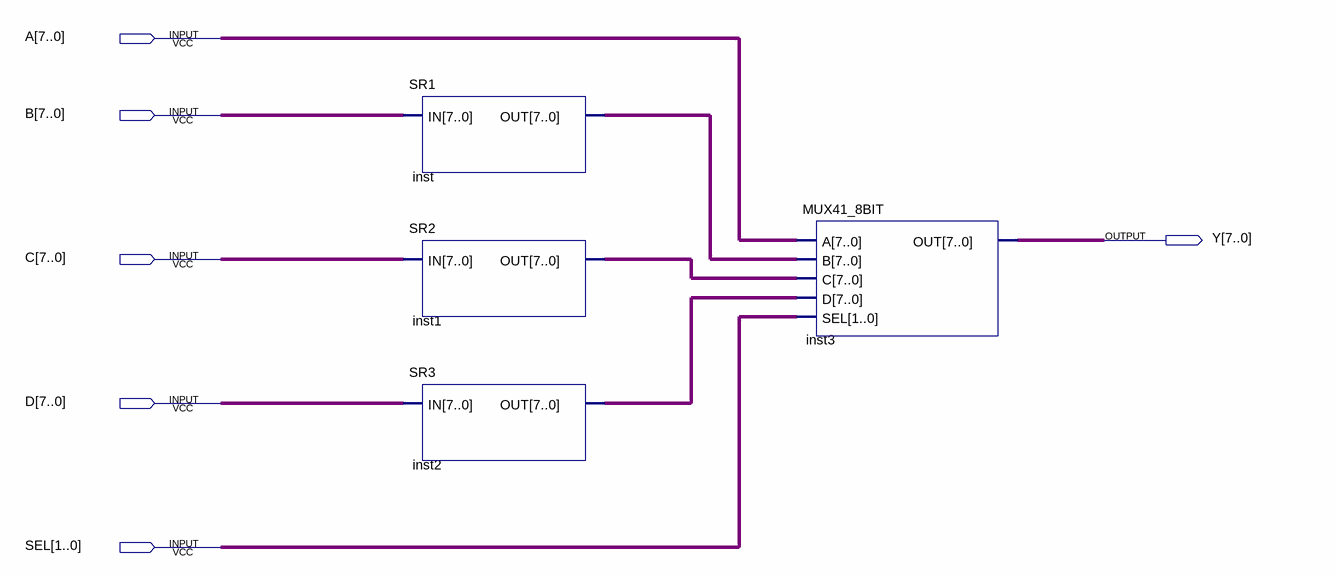
[diagram p0: schematic sheet]
// Quartus schematic SHIFT_LEFT.bdf as structural Verilog: 4 symbols, 6 pins
module SHIFT_LEFT (
  input  [7:0] A,
  input  [7:0] B,
  input  [7:0] C,
  input  [7:0] D,
  input  [1:0] SEL,
  output [7:0] Y
);

  wire [7:0] inst1_out, inst2_out, inst_out;

  SR1 inst (.IN(B), .OUT(inst_out));
  SR2 inst1 (.IN(C), .OUT(inst1_out));
  SR3 inst2 (.IN(D), .OUT(inst2_out));
  MUX41_8BIT inst3 (.A(A), .B(inst_out), .C(inst1_out), .D(inst2_out), .SEL(SEL), .OUT(Y));
endmodule
